# Altium schematic sheet MaPan.SchDoc
size A4; SheetNumber: 2; SheetTotal: 2
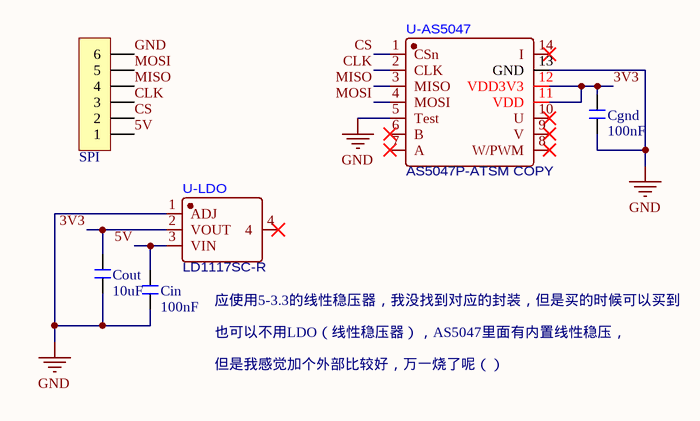
[diagram p0: MaPan.SchDoc]

## Parts
Cgnd  100nF  [C 0603_M]
Cin  100nF  [C 0603_M]
Cout  10uF  [C 0603_M]
SPI  HDR-1X6  [GH1.25-WS-6P]  (value not drawn)
U-AS5047  AS5047P-ATSM COPY  [TSSOP-14_L5.0-W4.4-P0.65-LS6.4-BL]
U-LDO  LD1117SC-R  [SOT-223-3_L6.5-W3.4-P2.30-LS7.0-BR]

## Nets
GND: Cgnd.1 Cin.1 Cout.1 SPI.6 U-AS5047.5(Test) U-AS5047.13(GND) U-LDO.1(ADJ)
3V3: Cgnd.2 Cout.2 U-AS5047.11(VDD) U-AS5047.12(VDD3V3) U-LDO.2(VOUT)
5V: Cin.2 SPI.1 U-LDO.3(VIN)
CLK: SPI.3 U-AS5047.2(CLK)
CS: SPI.2 U-AS5047.1(CSn)
MISO: SPI.4 U-AS5047.3(MISO)
MOSI: SPI.5 U-AS5047.4(MOSI)

Not connected (* = marked no-connect by the designer): U-AS5047 6(B)* 7(A)* 8(W/PWM)* 9(V)* 10(U)* 14(I)*; U-LDO 4*

## Notes on the sheet
- 应使用5-3.3的线性稳压器，我没找到对应的封装，但是买的时候可以买到
- 也可以不用LDO（线性稳压器），AS5047里面有内置线性稳压，
- 但是我感觉加个外部比较好，万一烧了呢（）

## Library data of the parts
Cgnd Cin Cout = C: 贴片电容; 淘宝ID: 小糖豆的小窝窝; BOM名称: 贴片电容; 下单链接: https://item.taobao.com/item.htm?ft=t&id=613637044352
SPI = Header 6: 6P接插件; 淘宝ID: 小糖豆的小窝窝; BOM名称: 6P接插件; 下单链接: https://item.taobao.com/item.htm?ft=t&id=613637044352